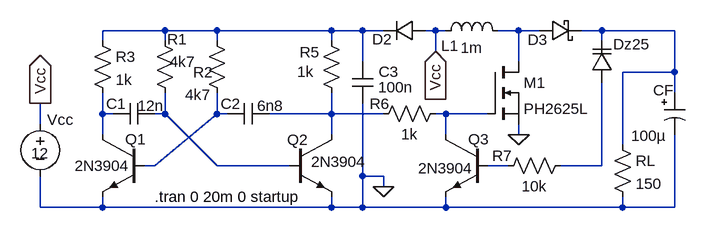
[diagram p0: schematic 12_24.asc]
12_24.asc, the LTspice schematic file:
Version 4
SHEET 1 880 680
WIRE -80 32 -176 32
WIRE 0 32 -80 32
WIRE 176 32 0 32
WIRE 224 32 176 32
WIRE 256 32 224 32
WIRE 336 32 320 32
WIRE 352 32 336 32
WIRE 464 32 432 32
WIRE 496 32 464 32
WIRE 592 32 560 32
WIRE 704 32 592 32
WIRE -176 48 -176 32
WIRE -80 48 -80 32
WIRE 0 48 0 32
WIRE 176 48 176 32
WIRE 592 48 592 32
WIRE 336 64 336 32
WIRE 224 80 224 32
WIRE 464 80 464 32
WIRE 704 96 704 32
WIRE 704 96 624 96
WIRE 704 128 704 96
WIRE -176 160 -176 128
WIRE -160 160 -176 160
WIRE -80 160 -80 128
WIRE -80 160 -96 160
WIRE 0 160 0 128
WIRE 16 160 0 160
WIRE 176 160 176 128
WIRE 176 160 80 160
WIRE 256 160 176 160
WIRE 352 160 336 160
WIRE 416 160 352 160
WIRE -272 176 -272 144
WIRE -176 192 -176 160
WIRE 176 192 176 160
WIRE 352 192 352 160
WIRE 464 192 464 176
WIRE 624 208 624 96
WIRE -96 240 0 160
WIRE -96 240 -112 240
WIRE 0 240 -80 160
WIRE 112 240 0 240
WIRE 448 240 416 240
WIRE 592 240 592 112
WIRE 592 240 528 240
WIRE 224 256 224 144
WIRE 256 256 224 256
WIRE 256 272 256 256
WIRE -272 304 -272 256
WIRE -176 304 -176 288
WIRE -176 304 -272 304
WIRE 176 304 176 288
WIRE 176 304 -176 304
WIRE 224 304 224 256
WIRE 224 304 176 304
WIRE 352 304 352 288
WIRE 352 304 224 304
WIRE 624 304 624 288
WIRE 624 304 352 304
WIRE 704 304 704 192
WIRE 704 304 624 304
FLAG 256 272 0
FLAG 464 192 0
FLAG 336 64 Vcc
IOPIN 336 64 In
FLAG -272 144 Vcc
IOPIN -272 144 Out
SYMBOL npn2 112 192 R0
WINDOW 0 -4 8 Left 0
WINDOW 3 33 42 Left 0
SYMATTR InstName Q2
SYMATTR Value 2N3904
SYMBOL npn2 -112 192 M0
WINDOW 0 -3 7 Left 0
WINDOW 3 22 48 Left 0
SYMATTR InstName Q1
SYMATTR Value 2N3904
SYMBOL cap -96 144 R90
WINDOW 0 16 59 VBottom 0
WINDOW 3 -12 6 VTop 0
SYMATTR InstName C1
SYMATTR Value 12n
SYMBOL cap 80 144 R90
WINDOW 0 16 59 VBottom 0
WINDOW 3 -12 -2 VTop 0
SYMATTR InstName C2
SYMATTR Value 6n8
SYMBOL res -96 32 R0
WINDOW 0 19 13 Left 0
WINDOW 3 23 48 Left 0
SYMATTR InstName R1
SYMATTR Value 4k7
SYMBOL res -16 32 R0
WINDOW 0 -21 64 Left 0
WINDOW 3 -33 99 Left 0
SYMATTR InstName R2
SYMATTR Value 4k7
SYMBOL res -192 32 R0
SYMATTR InstName R3
SYMATTR Value 1k
SYMBOL cap 208 80 R0
WINDOW 0 41 15 Left 0
WINDOW 3 40 39 Left 0
SYMATTR InstName C3
SYMATTR Value 100n
SYMBOL res 160 32 R0
WINDOW 0 -33 33 Left 0
WINDOW 3 -37 63 Left 0
SYMATTR InstName R5
SYMATTR Value 1k
SYMBOL diode 320 16 R90
WINDOW 0 45 66 VBottom 0
WINDOW 3 32 32 Invisible 0
SYMATTR InstName D2
SYMATTR Value MURS120
SYMBOL ind 336 48 R270
WINDOW 0 -23 22 VTop 0
WINDOW 3 5 56 VBottom 0
SYMATTR InstName L1
SYMATTR Value 1m
SYMATTR SpiceLine Ipk=0.13 Rser=5 Rpar=109964 Cpar=3.11p mfg="Wurth Elektronik" pn="744062102 WE-TPC X"
SYMBOL res 352 144 R90
WINDOW 0 16 102 VBottom 0
WINDOW 3 32 56 VTop 0
SYMATTR InstName R6
SYMATTR Value 1k
SYMBOL npn2 416 192 M0
WINDOW 0 -3 7 Left 0
WINDOW 3 22 52 Left 0
SYMATTR InstName Q3
SYMATTR Value 2N3904
SYMBOL schottky 496 16 M90
WINDOW 0 46 -3 VBottom 0
WINDOW 3 32 32 Invisible 0
SYMATTR InstName D3
SYMATTR Value MBRS360
SYMATTR Description Diode
SYMATTR Type diode
SYMBOL nmos 416 80 R0
SYMATTR InstName M1
SYMATTR Value PH2625L
SYMBOL polcap 688 128 R0
WINDOW 0 -17 -4 Left 0
WINDOW 3 -51 66 Left 0
SYMATTR InstName CF
SYMATTR Value 100µ
SYMATTR Description Capacitor
SYMATTR Type cap
SYMATTR SpiceLine V=35 Irms=1.98 Rser=0.029 MTBF=5000 Lser=0 Rpar=1000 mfg="Nichicon" pn="UPL1V102MRH" type="Al electrolytic" ppPkg=1
SYMBOL varactor 608 112 R180
WINDOW 0 -58 59 Left 0
WINDOW 3 24 0 Invisible 0
SYMATTR InstName Dz25
SYMATTR Value MV2201
SYMATTR Type diode
SYMBOL res 544 224 R90
WINDOW 0 16 105 VBottom 0
WINDOW 3 32 56 VTop 0
SYMATTR InstName R7
SYMATTR Value 10k
SYMBOL voltage -272 160 R0
WINDOW 0 11 9 Left 0
WINDOW 3 -14 61 Left 0
WINDOW 123 0 0 Left 0
SYMATTR InstName Vcc
SYMATTR Value 12
SYMATTR SpiceLine Rser=10m
SYMBOL res 608 192 R0
SYMATTR InstName RL
SYMATTR Value 150
TEXT -96 288 Left 0 !.tran 0 20m 0 startup

The netlist it stands for:
* 12_24.asc
Q2 N007 N005 0 0 2N3904
Q1 N004 N006 0 0 2N3904
C1 N005 N004 12n
C2 N007 N006 6n8
R1 N001 N005 4k7
R2 N001 N006 4k7
R3 N001 N004 1k
C3 N001 0 100n
R5 N001 N007 1k
D2 Vcc N001 MURS120
L1 Vcc N002 1m Ipk=0.13 Rser=5 Rpar=109964 Cpar=3.11p mfg="Wurth Elektronik" pn="744062102 WE-TPC X"
R6 N008 N007 1k
Q3 N008 N009 0 0 2N3904
D3 N002 N003 MBRS360
M1 N002 N008 0 0 PH2625L
CF N003 0 100µ V=35 Irms=1.98 Rser=0.029 MTBF=5000 Lser=0 Rpar=1000 mfg="Nichicon" pn="UPL1V102MRH" type="Al electrolytic" ppPkg=1
Dz25 N010 N003 MV2201
R7 N010 N009 10k
Vcc Vcc 0 12 Rser=10m
RL N003 0 150
.model D D
.lib standard.dio
.model NPN NPN
.model PNP PNP
.lib standard.bjt
.model NMOS NMOS
.model PMOS PMOS
.lib standard.mos
.tran 0 20m 0 startup
.backanno
.end